# Altium schematic sheet switches.SchDoc
size A4; SheetNumber: 1; SheetTotal: 1
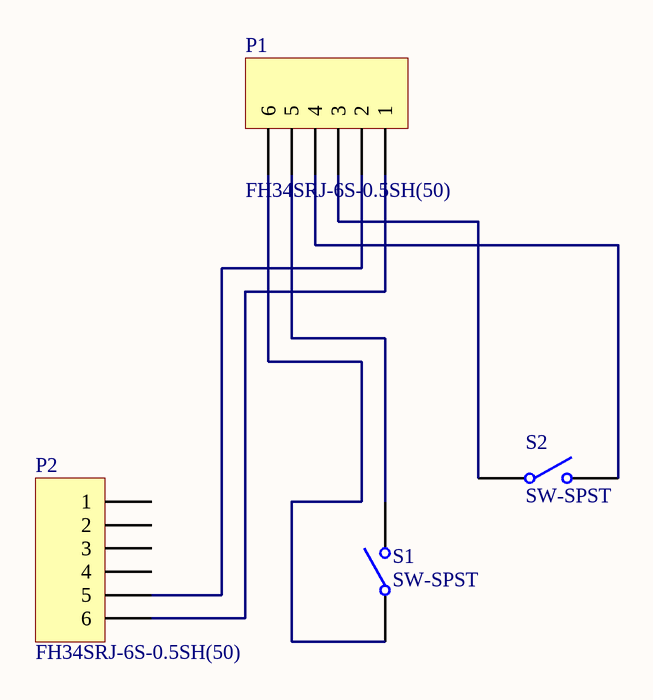
[diagram p0: switches.SchDoc]

## Parts
P1  FH34SRJ-6S-0.5SH(50)  [HRS_FH34SRJ-6S-0.5SH(50)]
P2  FH34SRJ-6S-0.5SH(50)  [HRS_FH34SRJ-6S-0.5SH(50)]
S1  SW-SPST  [ESE22MH22]
S2  SW-SPST  [ESE22MH24]

## Nets
NetP1_1: P1.1 P2.6
NetP1_2: P1.2 P2.5
NetP1_3: P1.3 S2.1(COMMON)
NetP1_4: P1.4 S2.2(NO)
NetP1_5: P1.5 S1.2(NO)
NetP1_6: P1.6 S1.1(COMMON)

Not connected (* = marked no-connect by the designer): P2 1 2 3 4

## Library data of the parts
P1 P2 = Header 6: Header, 6-Pin; MYPN: J-FH34SRJ-6S-0.5SH(50); VENDOR: HRS; LatestRevisionDate: 17-Jul-2002; LatestRevisionNote: Re-released for DXP Platform.; Publisher: Altium Limited; MPN: FH34SRJ-6S-0.5SH(50)
S1 S2 = SW-SPST: Single-Pole, Single-Throw Switch; MFG: Panasonic; Published: 24-Mar-1999; LatestRevisionDate: 17-Jul-2002; LatestRevisionNote: Re-released for DXP Platform.; PackageReference: SPST-2; Publisher: Altium Limited
  S1: MPN: ESE22MH22
  S2: MPN: ESE22MH24